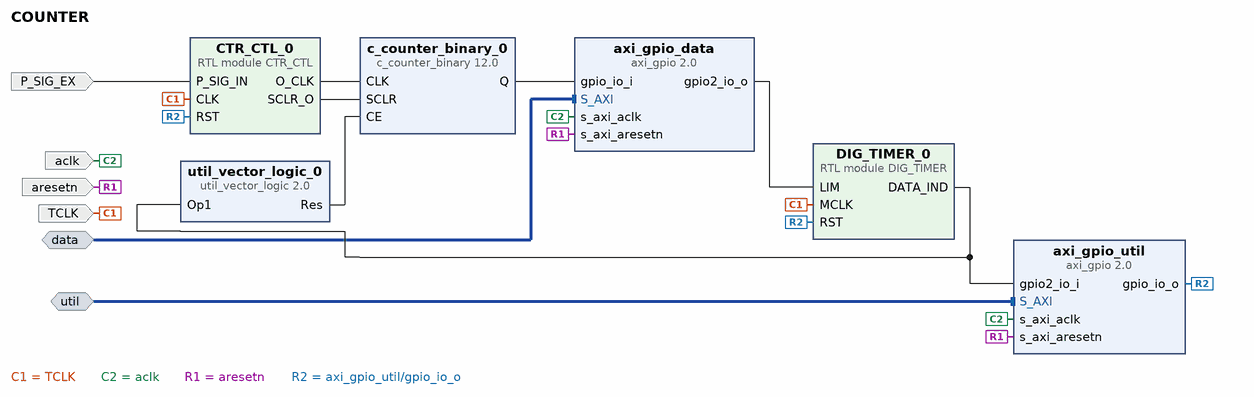
[diagram p0: block diagram of the top level]
# Vivado block design COUNTER, xc7z020clg400-1, Vivado 2019.1
create_bd_design COUNTER

create_bd_intf_port -mode Slave -vlnv xilinx.com:interface:aximm_tlm:1.0 data
create_bd_intf_port -mode Slave -vlnv xilinx.com:interface:aximm_tlm:1.0 util
create_bd_port -dir I TCLK
create_bd_port -dir I P_SIG_EX
create_bd_port -dir I aresetn
create_bd_port -dir I aclk

create_bd_cell -type ip -vlnv xilinx.com:ip:axi_gpio:2.0 axi_gpio_data
set_property -dict {CONFIG.C_ALL_INPUTS 1 CONFIG.C_ALL_OUTPUTS_2 1 CONFIG.C_IS_DUAL 1} [get_bd_cells axi_gpio_data]
create_bd_cell -type ip -vlnv xilinx.com:ip:axi_gpio:2.0 axi_gpio_util
set_property -dict [list \
  CONFIG.C_ALL_INPUTS 0 \
  CONFIG.C_ALL_INPUTS_2 1 \
  CONFIG.C_ALL_OUTPUTS 1 \
  CONFIG.C_GPIO2_WIDTH 1 \
  CONFIG.C_GPIO_WIDTH 1 \
  CONFIG.C_IS_DUAL 1 \
] [get_bd_cells axi_gpio_util]
create_bd_cell -type ip -vlnv xilinx.com:ip:c_counter_binary:12.0 c_counter_binary_0
set_property -dict [list \
  CONFIG.CE true \
  CONFIG.Implementation DSP48 \
  CONFIG.Output_Width 32 \
  CONFIG.SCLR true \
] [get_bd_cells c_counter_binary_0]
create_bd_cell -type module -reference DIG_TIMER DIG_TIMER_0
create_bd_cell -type ip -vlnv xilinx.com:ip:util_vector_logic:2.0 util_vector_logic_0
set_property -dict {CONFIG.C_OPERATION not CONFIG.C_SIZE 1} [get_bd_cells util_vector_logic_0]
create_bd_cell -type module -reference CTR_CTL CTR_CTL_0

# ---- connections ----

connect_bd_intf_net -intf_net S_AXI_0_1 [get_bd_intf_ports data] [get_bd_intf_pins axi_gpio_data/S_AXI]
connect_bd_intf_net -intf_net s_axi_1_1 [get_bd_intf_ports util] [get_bd_intf_pins axi_gpio_util/S_AXI]
connect_bd_net [get_bd_ports TCLK] [get_bd_pins DIG_TIMER_0/MCLK] [get_bd_pins CTR_CTL_0/CLK]
connect_bd_net [get_bd_pins axi_gpio_data/gpio2_io_o] [get_bd_pins DIG_TIMER_0/LIM]
connect_bd_net -net s_axi_clk_1 [get_bd_ports aclk] [get_bd_pins axi_gpio_data/s_axi_aclk] [get_bd_pins axi_gpio_util/s_axi_aclk]
connect_bd_net -net s_axi_rst_1 [get_bd_ports aresetn] [get_bd_pins axi_gpio_data/s_axi_aresetn] [get_bd_pins axi_gpio_util/s_axi_aresetn]
connect_bd_net [get_bd_pins DIG_TIMER_0/DATA_IND] [get_bd_pins axi_gpio_util/gpio2_io_i] [get_bd_pins util_vector_logic_0/Op1]
connect_bd_net [get_bd_ports P_SIG_EX] [get_bd_pins CTR_CTL_0/P_SIG_IN]
connect_bd_net [get_bd_pins axi_gpio_util/gpio_io_o] [get_bd_pins DIG_TIMER_0/RST] [get_bd_pins CTR_CTL_0/RST]
connect_bd_net [get_bd_pins CTR_CTL_0/O_CLK] [get_bd_pins c_counter_binary_0/CLK]
connect_bd_net [get_bd_pins CTR_CTL_0/SCLR_O] [get_bd_pins c_counter_binary_0/SCLR]
connect_bd_net [get_bd_pins c_counter_binary_0/Q] [get_bd_pins axi_gpio_data/gpio_io_i]
connect_bd_net [get_bd_pins util_vector_logic_0/Res] [get_bd_pins c_counter_binary_0/CE]

validate_bd_design
save_bd_design
